# EAGLE design main board (EAGLE 7.7.0)
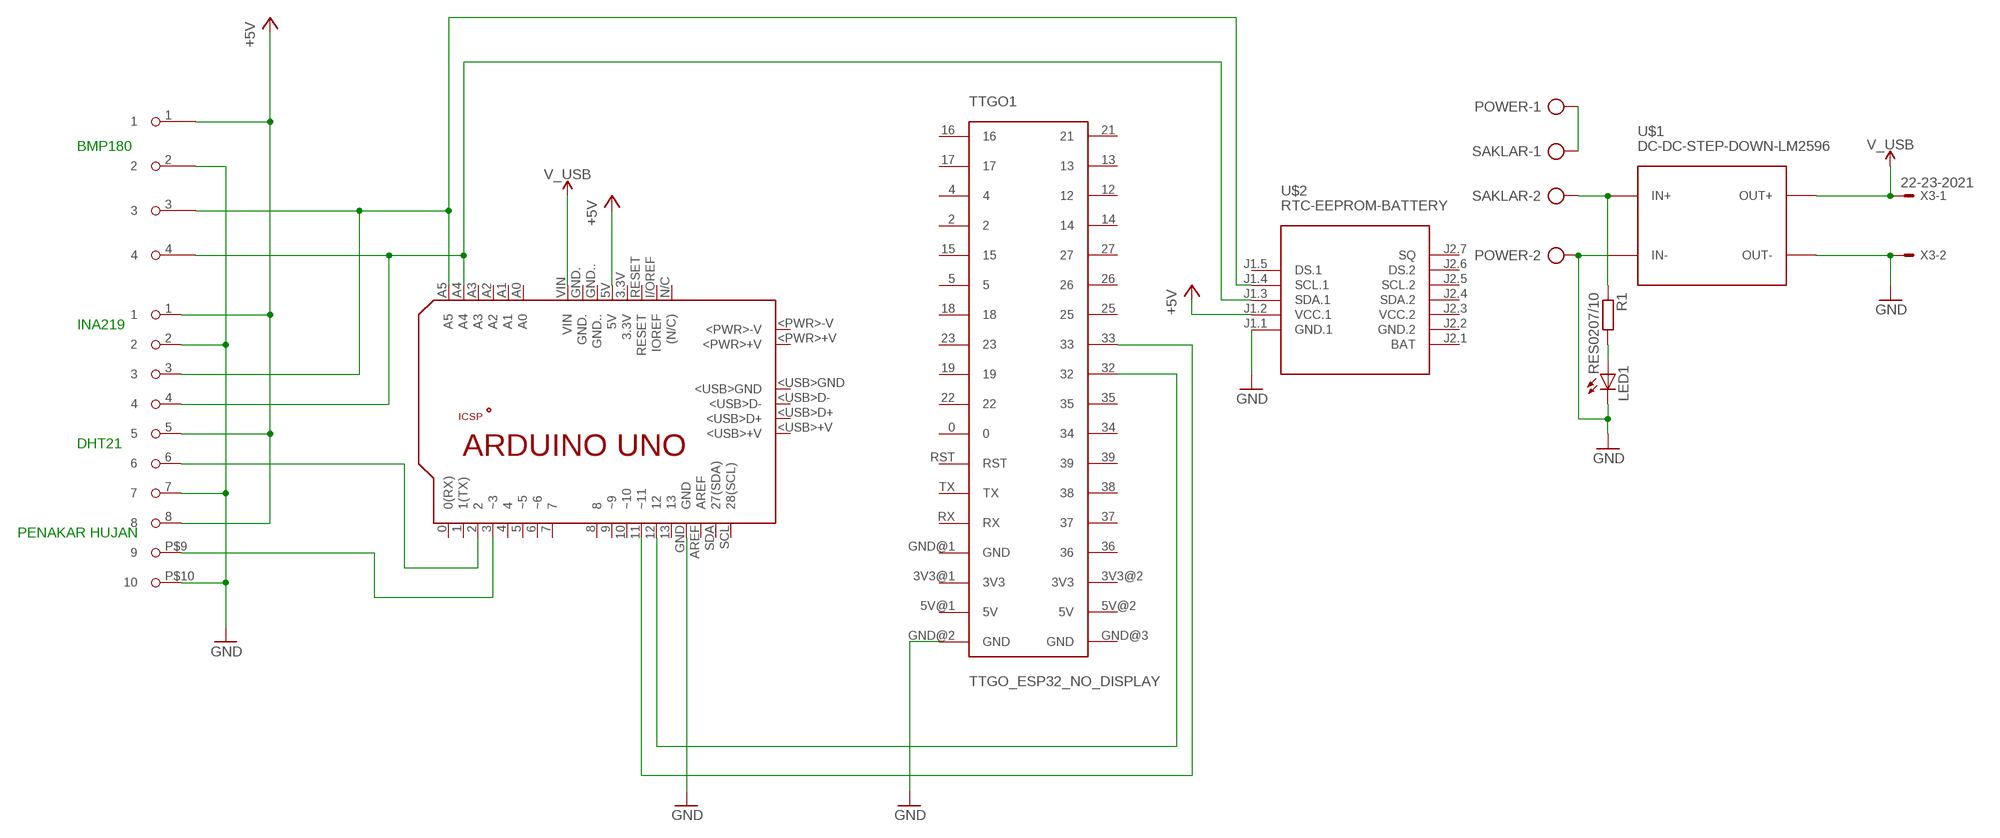
[diagram p0: schematic, sheet 1]

## Parts
LED1  LED5MM  [LED5MM]
PCB1  ARDUINO_UNO  [ARDUINO_UNO]
POWER  AK500/2-H  [AK500/2-H]
R1  RES0207/10  [0207/10]
SAKLAR  AK500/2-H  [AK500/2-H]
TTGO1  TTGO_ESP32_NO_DISPLAY  [TTGO_ESP32_NO_DISPLAY]
U$1  DC-DC-STEP-DOWN-LM2596  [DC-DC-STEP-DOWN-LM2596]
U$2  RTC-EEPROM-BATTERY  [RTC-EEPROM-BATTERY]
U$3  CON-10TA  [CON-10TA]
U$4  CON-4NEW2  [CON-4NEW]
X3  22-23-2021  [22-23-2021]

## Nets
+5V: PCB1.5V U$2.J1.2(VCC.1) U$3.1 U$3.5 U$3.8 U$4.1
N$1: R1.1 SAKLAR.2 U$1.IN+
N$2: LED1.A R1.2
N$3: POWER.1 SAKLAR.1
N$4: PCB1.A5 U$2.J1.4(SCL.1) U$3.3 U$4.3
N$5: PCB1.A4 U$2.J1.3(SDA.1) U$3.4 U$4.4
N$6: PCB1.2 U$3.6
N$7: PCB1.3(~3) U$3.P$9
N$8: PCB1.11(~11) TTGO1.33
N$9: PCB1.12 TTGO1.32
N$10: LED1.K(C) PCB1.GND POWER.2 TTGO1.GND@2(GND) U$1.IN- U$1.OUT- U$2.J1.1(GND.1) U$3.2 U$3.7 U$3.P$10 U$4.2 X3.2 ; supply symbol labelled GND
V_USB: PCB1.VIN U$1.OUT+ X3.1
Unconnected: PCB1.0(0(RX)) PCB1.1(1(TX)) PCB1.3.3V PCB1.4 PCB1.5(~5) PCB1.6(~6) PCB1.7 PCB1.8 PCB1.9(~9) PCB1.10(~10) PCB1.13 PCB1.+5V PCB1.<PWR>+V PCB1.<PWR>-V PCB1.<USB>+V PCB1.<USB>D+ PCB1.<USB>D- PCB1.<USB>GND PCB1.A0 PCB1.A1 PCB1.A2 PCB1.A3 PCB1.AREF PCB1.GND. PCB1.GND.. PCB1.GND_ PCB1.I/OREF(IOREF) PCB1.MISO PCB1.MOSI PCB1.N/C((N/C)) PCB1.RESET PCB1.RESET. PCB1.SCK PCB1.SCL(28(SCL)) PCB1.SDA(27(SDA)) TTGO1.0 TTGO1.2 TTGO1.3V3@1(3V3) TTGO1.3V3@2(3V3) TTGO1.4 TTGO1.5 TTGO1.5V@1(5V) TTGO1.5V@2(5V) TTGO1.12 TTGO1.13 TTGO1.14 TTGO1.15 TTGO1.16 TTGO1.17 TTGO1.18 TTGO1.19 TTGO1.21 TTGO1.22 TTGO1.23 TTGO1.25 TTGO1.26 TTGO1.27 TTGO1.34 TTGO1.35 TTGO1.36 TTGO1.37 TTGO1.38 TTGO1.39 TTGO1.GND@1(GND) TTGO1.GND@3(GND) TTGO1.RST TTGO1.RX TTGO1.TX U$2.J1.5(DS.1) U$2.J2.1(BAT) U$2.J2.4(SDA.2) U$2.J2.5(SCL.2) U$2.J2.6(DS.2) U$2.J2.7(SQ)

## Notes on the sheet
- BMP180
- INA219
- DHT21
- PENAKAR HUJAN

## Power pins joined to a net without a drawn wire
GND.2: U$2.J2.2(GND.2)
VCC.2: U$2.J2.3(VCC.2)

## Library data of the parts
LED1 = led:LED: LED OSRAM: - CHIPLED LG R971, LG N971, LY N971, LG Q971, LY Q971, LO R971, LY R971 LH N974, LH R974 LS Q976, LO Q976, LY Q976 LO Q996 - Hyper CHIPLED LW Q18S LB Q993, LB Q99A, LB R99A - SideLED LS A670, LO A670, LY A670, LG A670, LP A670 LB A673, LV A673, LT A673, LW A673 LH A674 LY A675 LS A676, LA A676, LO A676, LY A676, LW A676 LS A679, LY A679, LG A679 - Hyper Micro SIDELED® LS Y876, LA Y876, LO Y876, LY Y876 LT Y87S - SmartLED LW L88C, LW L88S LB L89C, LB L89S, LG L890 LS L89K, LO L89K, LY L89K LS L896, LA L896, LO L896, LY L896 - TOPLED LS T670, LO T670, LY T670, LG T670, LP T670 LSG T670, LSP T670, LSY T670, LOP T670, LYG T670 LG T671, LOG T671, LSG T671 LB T673, LV T673, LT T673, LW T673 LH T674 LS T676, LA T676, LO T676, LY T676, LB T676, LH T676, LSB T676, LW T676 LB T67C, LV T67C, LT T67C, LS T67K, LO T67K, LY T67K, LW E67C LS E67B, LA E67B, LO E67B, LY E67B, LB E67C, LV E67C, LT E67C LW T67C LS T679, LY T679, LG T679 LS T770, LO T770, LY T770, LG T770, LP T770 LB T773, LV T773, LT T773, LW T773 LH T774 LS E675, LA E675, LY E675, LS T675 LS T776, LA T776, LO T776, LY T776, LB T776 LHGB T686 LT T68C, LB T68C - Hyper Mini TOPLED® LB M676 - Mini TOPLED Santana® LG M470 LS M47K, LO M47K, LY M47K Source: http://www.osram.convergy.de LUXEON: - LUMILED® LXK2-PW12-R00, LXK2-PW12-S00, LXK2-PW14-U00, LXK2-PW14-V00 LXK2-PM12-R00, LXK2-PM12-S00, LXK2-PM14-U00 LXK2-PE12-Q00, LXK2-PE12-R00, LXK2-PE12-S00, LXK2-PE14-T00, LXK2-PE14-U00 LXK2-PB12-K00, LXK2-PB12-L00, LXK2-PB12-M00, LXK2-PB14-N00, LXK2-PB14-P00, LXK2-PB14-Q00 LXK2-PR12-L00, LXK2-PR12-M00, LXK2-PR14-Q00, LXK2-PR14-R00 LXK2-PD12-Q00, LXK2-PD12-R00, LXK2-PD12-S00 LXK2-PH12-R00, LXK2-PH12-S00 LXK2-PL12-P00, LXK2-PL12-Q00, LXK2-PL12-R00 Source: www.luxeon.com KINGBRIGHT: KA-3528ASYC Source: www.kingbright.com
PCB1 = arduino:ARDUINO_UNO: Device for representing an Arduino Uno board with a footprint in an EAGLE design. Created by Dave Young for Element14. More EAGLE documentation at: http://www.element14.com/community/community/knode/cadsoft_eagle
POWER SAKLAR = con-ptr500:AK500/2-H: CONNECTOR Aug. 2004 / PTR Meßtechnik: Die Bezeichnung der Serie AK505 wurde geändert. Es handelt sich hierbei um AK500 in horizontaler Ausführung.; OC_FARNELL: unknown; OC_NEWARK: unknown
R1 = 00-Library LKS 2019:RES: RESISTOR, European symbol; SPICEPREFIX: R
TTGO1 = TTGO_32_without_display:TTGO_ESP32_NO_DISPLAY
U$1 = diy-modules:DC-DC-STEP-DOWN-LM2596: DC/DC Step-Down Regulator based on LM2596-ADJ chip LM2596 datasheet available here: http://www.ti.com/lit/ds/symlink/lm2596.pdf Click here to find device on ebay.com <http://www.ebay.com/sch/lm2596+power+regulator>
U$2 = diy-modules:RTC-EEPROM-BATTERY: RTC Module with Battery and EEPROM based on DS1307 and AT24C32 chips More details available here: http://henrysbench.capnfatz.com/henrys-bench/arduino-sensors-and-input/arduino-tiny-rtc-d1307-tutorial/ Click here to find device on ebay.com <http://www.ebay.com/sch/tiny+rtc+arduino>
U$3 = CON-10TA:CON-10TA
U$4 = CON-4NEW:CON-4NEW2: CON-4 buatan sendiri terbaru banget 3/6/2022
X3 = con-molex:22-23-2021: .100" (2.54mm) Center Header - 2 Pin; MF: MOLEX; MPN: 22-23-2021; OC_FARNELL: 1462926; OC_NEWARK: 25C3832

## Board
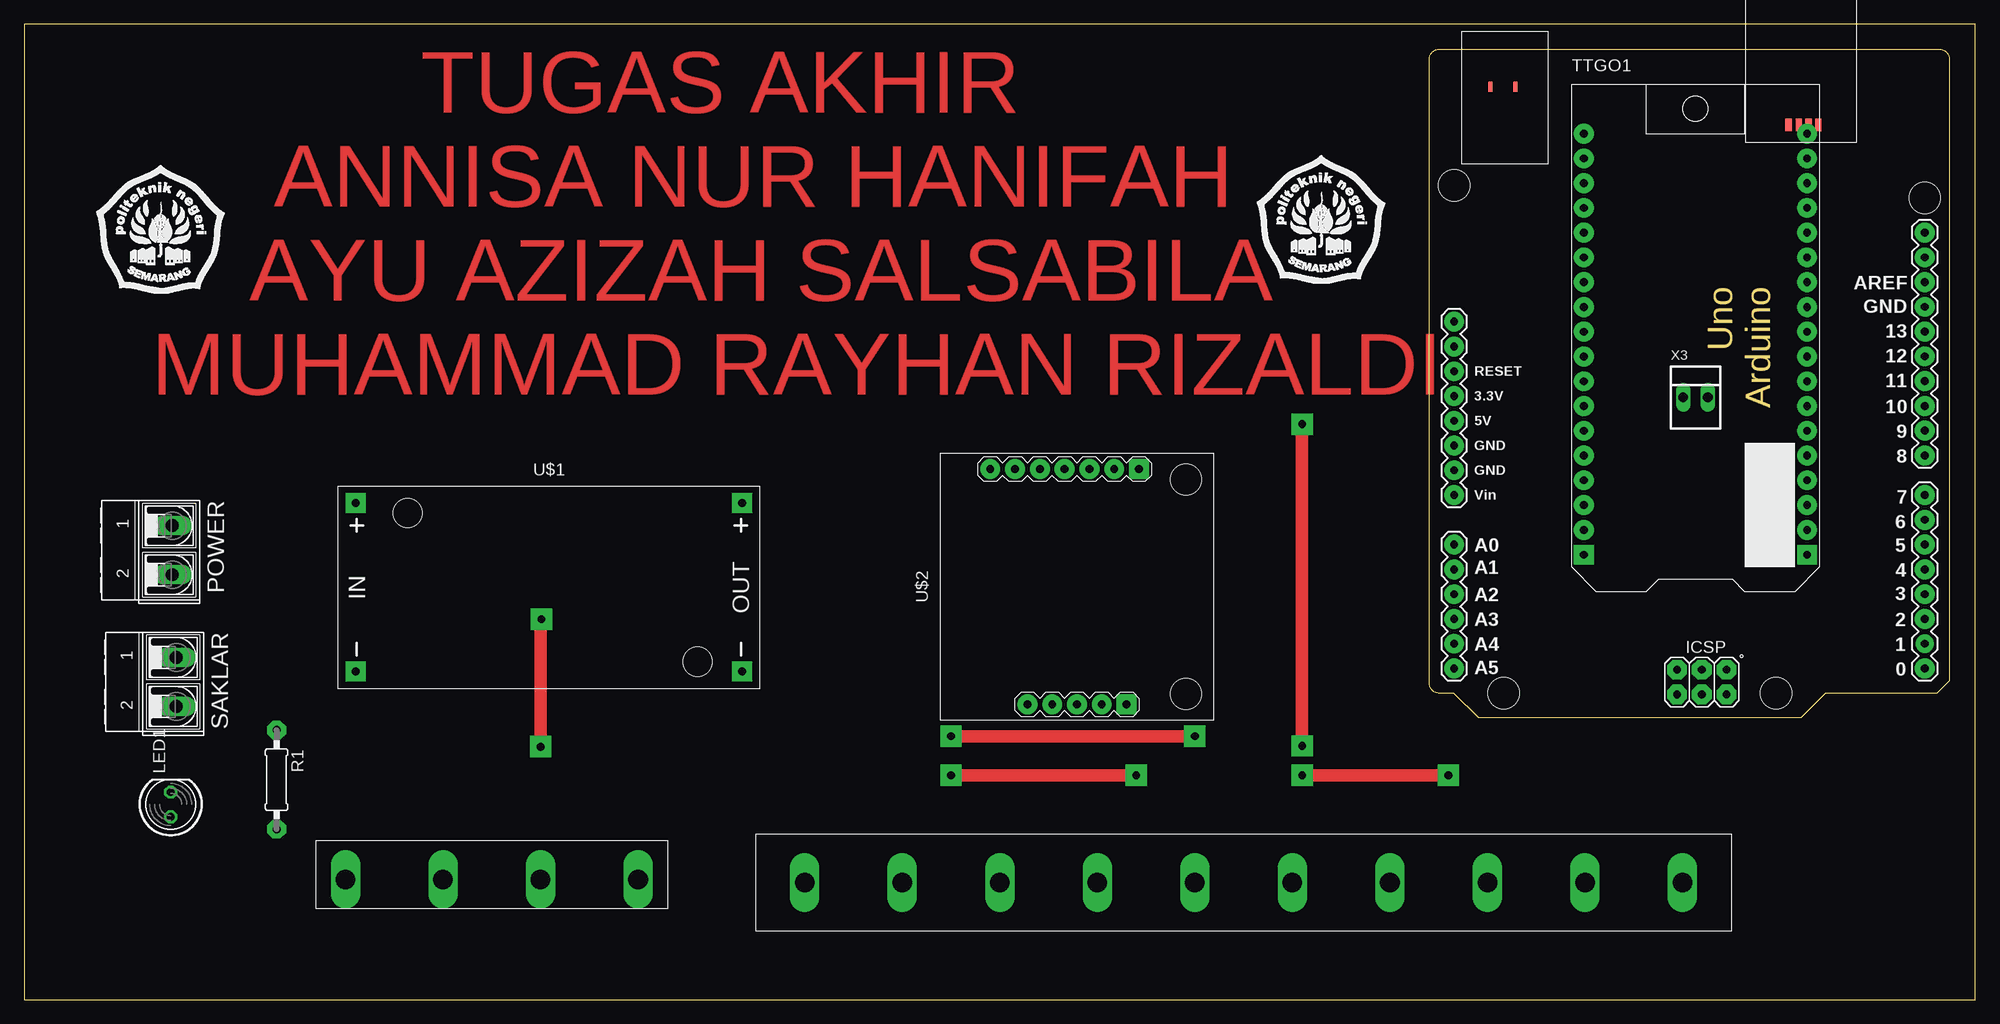
[diagram p1: board, top side]
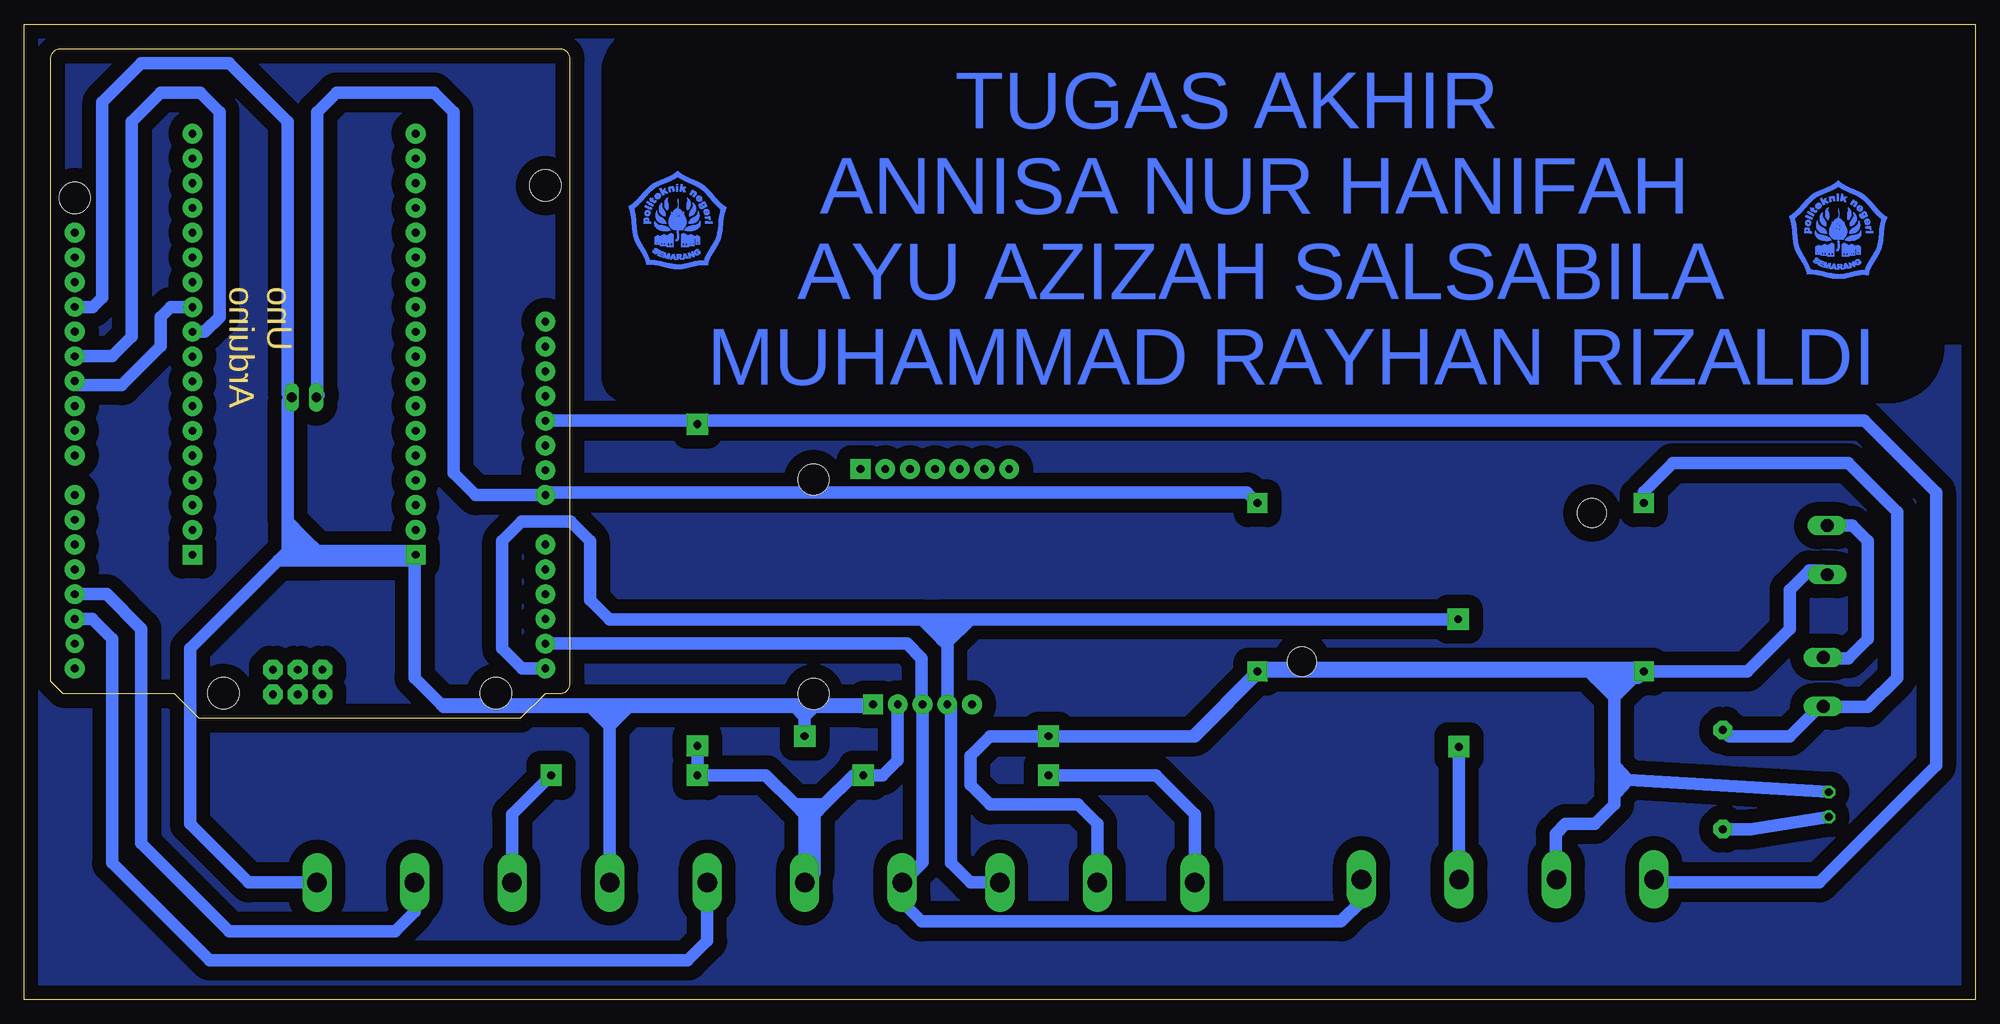
[diagram p2: board, bottom side, seen from below]

Size 200 x 100 mm. Coordinates in mm from the lower left corner, seen from the top.
Outline: 0,0 200,0 200,100 0,100 0,0
Copper layers (1*16): Top 0.035mm / dielectric 1.5mm / Bottom 0.035mm
Design rules "default": minimum track width 10mil, minimum drill 24mil, track to track 8mil, track to pad 8mil, pad to pad 8mil, via to via 8mil, smd to smd 8mil, copper to edge 40mil, drill to drill 8mil, minimum pad ring 10mil, minimum via ring 8mil, stop-mask expansion 4mil, vias tented up to drill 0mil, thermal gap 10mil

### Footprints (pad centres in the part's own frame; a part is rotated, then mirrored left to right if it is on the bottom)
LED5MM = drill 0.813 octagon: A -1.27,0; K 1.27,0
ARDUINO_UNO = drill 0.8 pad 2.032: 0 63.5,50.8; 2 58.42,50.8; 3 55.88,50.8; 3.3V 35.56,2.54; 4 53.34,50.8; 5 50.8,50.8; 5V 38.1,2.54; 6 48.26,50.8; 7 45.72,50.8; 8 41.656,50.8; 9 39.116,50.8; 10 36.576,50.8; 11 34.036,50.8; 12 31.496,50.8; 13 28.956,50.8; A0 50.8,2.54; A1 53.34,2.54; A2 55.88,2.54; A3 58.42,2.54; A4 60.96,2.54; A5 63.5,2.54; AREF 23.876,50.8; GND 26.416,50.8; GND. 43.18,2.54; GND.. 40.64,2.54; I/OREF 30.48,2.54; N/C 27.94,2.54; RESET 33.02,2.54; SCL 18.796,50.8; SDA 21.336,50.8; VIN 45.72,2.54 | drill 0.8 pad 1.88: 1 60.96,50.8 | drill 0.8 pad 2.032 octagon: +5V 66.167,30.48; GND_ 66.167,25.4; MISO 63.627,30.48; MOSI 66.167,27.94; RESET. 63.627,25.4; SCK 63.627,27.94 | smd 1.016 x 0.508: <PWR>+V 3.861,8.814; <PWR>-V 3.861,6.274 | smd 1.27 x 0.635: <USB>+V 7.772,39.878; <USB>D+ 7.772,38.887; <USB>D- 7.772,37.871; <USB>GND 7.772,36.83 | hole 3.2: 66.04,7.62; 66.04,35.56; 15.24,50.8; 13.97,2.54
AK500/2-H = drill 1.321 long: 1 -2.515,0; 2 2.515,0
0207/10 = drill 0.813 pad 1.93 octagon: 1 -5.08,0; 2 5.08,0
TTGO_ESP32_NO_DISPLAY = drill 0.8 pad 2.032: 0 1.27,-30.48; 2 1.27,-12.7; 3V3@1 1.27,-43.18; 3V3@2 24.13,-43.18; 4 1.27,-10.16; 5 1.27,-17.78; 5V@1 1.27,-45.72; 5V@2 24.13,-45.72; 12 24.13,-10.16; 13 24.13,-7.62; 14 24.13,-12.7; 15 1.27,-15.24; 16 1.27,-5.08; 17 1.27,-7.62; 18 1.27,-20.32; 19 1.27,-25.4; 21 24.13,-5.08; 22 1.27,-27.94; 23 1.27,-22.86; 25 24.13,-20.32; 26 24.13,-17.78; 27 24.13,-15.24; 32 24.13,-25.4; 33 24.13,-22.86; 34 24.13,-30.48; 35 24.13,-27.94; 36 24.13,-40.64; 37 24.13,-38.1; 38 24.13,-35.56; 39 24.13,-33.02; GND@1 1.27,-40.64; RST 1.27,-33.02; RX 1.27,-38.1; TX 1.27,-35.56 | drill 0.8 pad 2.032 square: GND@2 1.27,-48.26; GND@3 24.13,-48.26
DC-DC-STEP-DOWN-LM2596 = drill 0.8 pad 2.032 square: IN+ -19.812,8.636; IN- -19.812,-8.636; OUT+ 19.812,8.636; OUT- 19.812,-8.636 | hole 3: -14.478,7.62; 15.24,-7.62
RTC-EEPROM-BATTERY = drill 0.8 pad 2.032 square: J1.1 -12.065,-5.08; J2.1 12.065,-6.35 | drill 0.8 pad 2.032: J1.2 -12.065,-2.54; J1.3 -12.065,0; J1.4 -12.065,2.54; J1.5 -12.065,5.08; J2.2 12.065,-3.81; J2.3 12.065,-1.27; J2.4 12.065,1.27; J2.5 12.065,3.81; J2.6 12.065,6.35; J2.7 12.065,8.89 | hole 3.2: -11,-11.176; 11,-11.176
CON-10TA = drill 2 pad 2.032 long: 1 -10,40; 2 -10,30; 3 -10,20; 4 -10,10; 5 -10,0; 7 -10,-20; P$9 -10,-40; P$10 -10,-50 | drill 2 pad 2.184 long: 6 -10,-10; 8 -10,-30
CON-4NEW = drill 2 pad 2.032 long: 1 -10,20; 2 -10,10; 3 -10,0; 4 -10,-10
22-23-2021 = drill 1 long: 1 -1.27,0; 2 1.27,0

### Placement (x,y rotation side)
LED1  15,20 90 top
PCB1  144.04,97.45 270 top
POWER  15.17,46.08 270 top
R1  25.85,22.55 270 top
SAKLAR  15.58,32.57 270 top
TTGO1  158.63,93.88 0 top
U$1  53.77,42.27 0 top
U$2  107.92,42.33 90 top
U$3  120,22 90 top
U$4  52.92,22.32 90 top
U$5  [POLINES_10X10_BOT]  14,79 0 top
U$6  [POLINES_10X10_BOT]  133,80 0 top
U$7  [POLINES_13.5X13.5]  14,79 0 top
U$8  [POLINES_13.5X13.5]  133,80 0 top
X3  171.33,61.75 0 top

### Tracks (layer width: path | path; a pad name or v marks a point on that pad's centre or on a via)
+5V  (via drill 0.8 pad 2.18)
  Top 1.27: v95,23 v114,23 | v131,23 v146,23 | v131,59 v131,26
  Bottom 1.27: U$4.1 32.6,12 16,12 4,24 4,52 11.35,59.35 PCB1.5V 131.35,59.35 v131,59 | U$3.1 80,19 84,23 v95,23 | 118,20 115,23 v114,23 112,23 110.46,24.54 U$2.J1.2 | 118,20 119,19 119,13 U$3.5 120,19 121,20 | 121,20 124,23 v131,23 v131,26 | v146,23 150,19 U$3.8 | 118,20 121,20
N$1
  Bottom 1.27: U$1.IN+ 33.96,52.04 31,55 13,55 8,50 8,33 11,30 15.53,30 SAKLAR.2 15.95,30.05 19,27 25.22,27 R1.1
N$2
  Bottom 1.27: R1.2 23.01,17.47 LED1.A
N$3
  Bottom 1.27: POWER.1 12.6,48.59 11,47 11,37 13,35 15.49,35 SAKLAR.1
N$4  (via drill 0.8 pad 2.18)
  Top 1.27: v52.92,25.92 52.92,38.92 v53,39
  Bottom 1.27: PCB1.A5 148.95,33.95 151,36 151,47 149,49 144,49 142,47 142,41 140,39 108,39 | 105.5,36.5 105.38,36.38 U$2.J1.4 105,29.89 105,14 103,12 U$3.3 | 105.5,36.5 106,37 | 106,37 108,39 | U$4.3 v52.92,25.92 | 103,39 105.5,36.5 | 103,39 104,39 | 104,39 106,39 | 108,39 106,39 | 106,39 106,37 | 106,37 104,39 | v53,39 103,39
N$5
  Bottom 1.27: PCB1.A4 109.49,36.49 108,35 108,30.34 U$2.J1.3 107.92,14.08 U$3.4 110,10 108,8 65,8 62.92,10.08 U$4.4
N$6
  Bottom 1.27: PCB1.2 193.03,39.03 191,37 191,14 181,4 132,4 130,6 U$3.6
N$7
  Bottom 1.27: PCB1.3 191.57,41.57 188,38 188,16 179,7 162,7 160,9 U$3.P$9
N$8
  Bottom 1.27: TTGO1.33 184.98,71.02 186,70 186,67 190,63 194.43,63 PCB1.11
N$9
  Bottom 1.27: TTGO1.32 181.52,68.48 180,70 180,91 182,93 186,93 189,90 189,68 191,66 194.79,66 PCB1.12
N$10  (via drill 0.8 pad 2.18)
  Top 1.27: v120,27 v95,27
  Bottom 1.27: 34,34 37,34 | 37,34 36,33 38,33 | LED1.K 35.54,22.54 36,23 | 36,23 37,24 | 37,24 37,31 | 37,31 35,33 34.59,33 U$1.IN- 23.37,33.63 19,38 19,42 17,44 15.61,44 POWER.2 | U$4.2 42.92,12.08 43,12.16 43,17 42,18 39,18 37,20 37,21 | 37,21 37,22 | 37,22 36,23 | 37,24 37,22 | 37,21 36,22 36,23 | 39,33 39.63,33.63 U$1.OUT- 80.22,27 v95,27 | 39,33 37,31 | 39,33 38,33 | 38,33 37,32 | 37,34 73,34 | 73,34 74,34 | TTGO1.GND@2 169.62,45.62 171.5,47.5 | 171.5,47.5 173,49 | 173,49 173,61.35 X3.2 173,62.15 173,90 179,96 188,96 192,92 192,72 193,71 194.81,71 PCB1.GND | 174,45 173,46 | 173,46 172,47 | 172,47 171.5,47.5 | 173,49 173,46 | 173,46 173,45 | 173,45 170,45 | 160,45 170,45 | 170,45 172,47 | 172,47 172,46 | 173,45 174,45 | U$3.7 140,28 | 140,28 138,30 | 138,30 121,30 | 121,30 120,30 | 120,30 119,30 | 119,30 113.27,30 U$2.J1.1 157.26,30.27 | U$3.P$10 177,12 183,18 183,36 174,45 | 173,46 161,46 160,45 | 160,45 160,33 157.26,30.27 | 157.26,30.27 157,30 142,30 | 142,30 140,28 | 138,30 140,30 | 140,30 140,28 | U$3.2 90,18 92,20 101,20 103,22 103,25 101,27 v95,27 | 142,30 140,30 | 120,30 120,29 | 120,29 v120,27 | v95,27 80,27 73,34 | 119,30 120,29 | 120,29 121,30
N$11
  pour Bottom (isolate 1.422): 0,0 200,0 200,100 136,100 arc-90 141,95 141,72 141,64 arc-90 138,61 9,61 arc-90 3,67 0,67
V_USB
  Bottom 1.27: 169.81,62 170,61.81 | 170,61.81 170,91 168,93 158,93 156,91 156,54 153.73,51.73 PCB1.VIN 146.31,52 74.68,52 U$1.OUT+ | 170,61.81 X3.1

### Text on the board
Top: TUGAS AKHIR / ANNISA NUR HANIFAH / AYU AZIZAH SALSABILA / MUHAMMAD RAYHAN RIZALDI
Bottom: TUGAS AKHIR / ANNISA NUR HANIFAH / AYU AZIZAH SALSABILA / MUHAMMAD RAYHAN RIZALDI